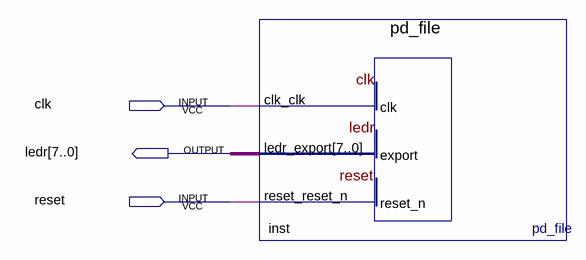
[diagram p0: schematic sheet]
// Quartus schematic NE0-AXI-Slave.bdf as structural Verilog: 1 symbols, 3 pins
module \NE0-AXI-Slave  (
  input  clk,
  input  reset,
  output [7:0] ledr
);

  pd_file inst (.clk_clk(clk), .reset_reset_n(reset), .ledr_export(ledr));
endmodule
